# EAGLE design RC2014_SIO2 (EAGLE 9.4.2)
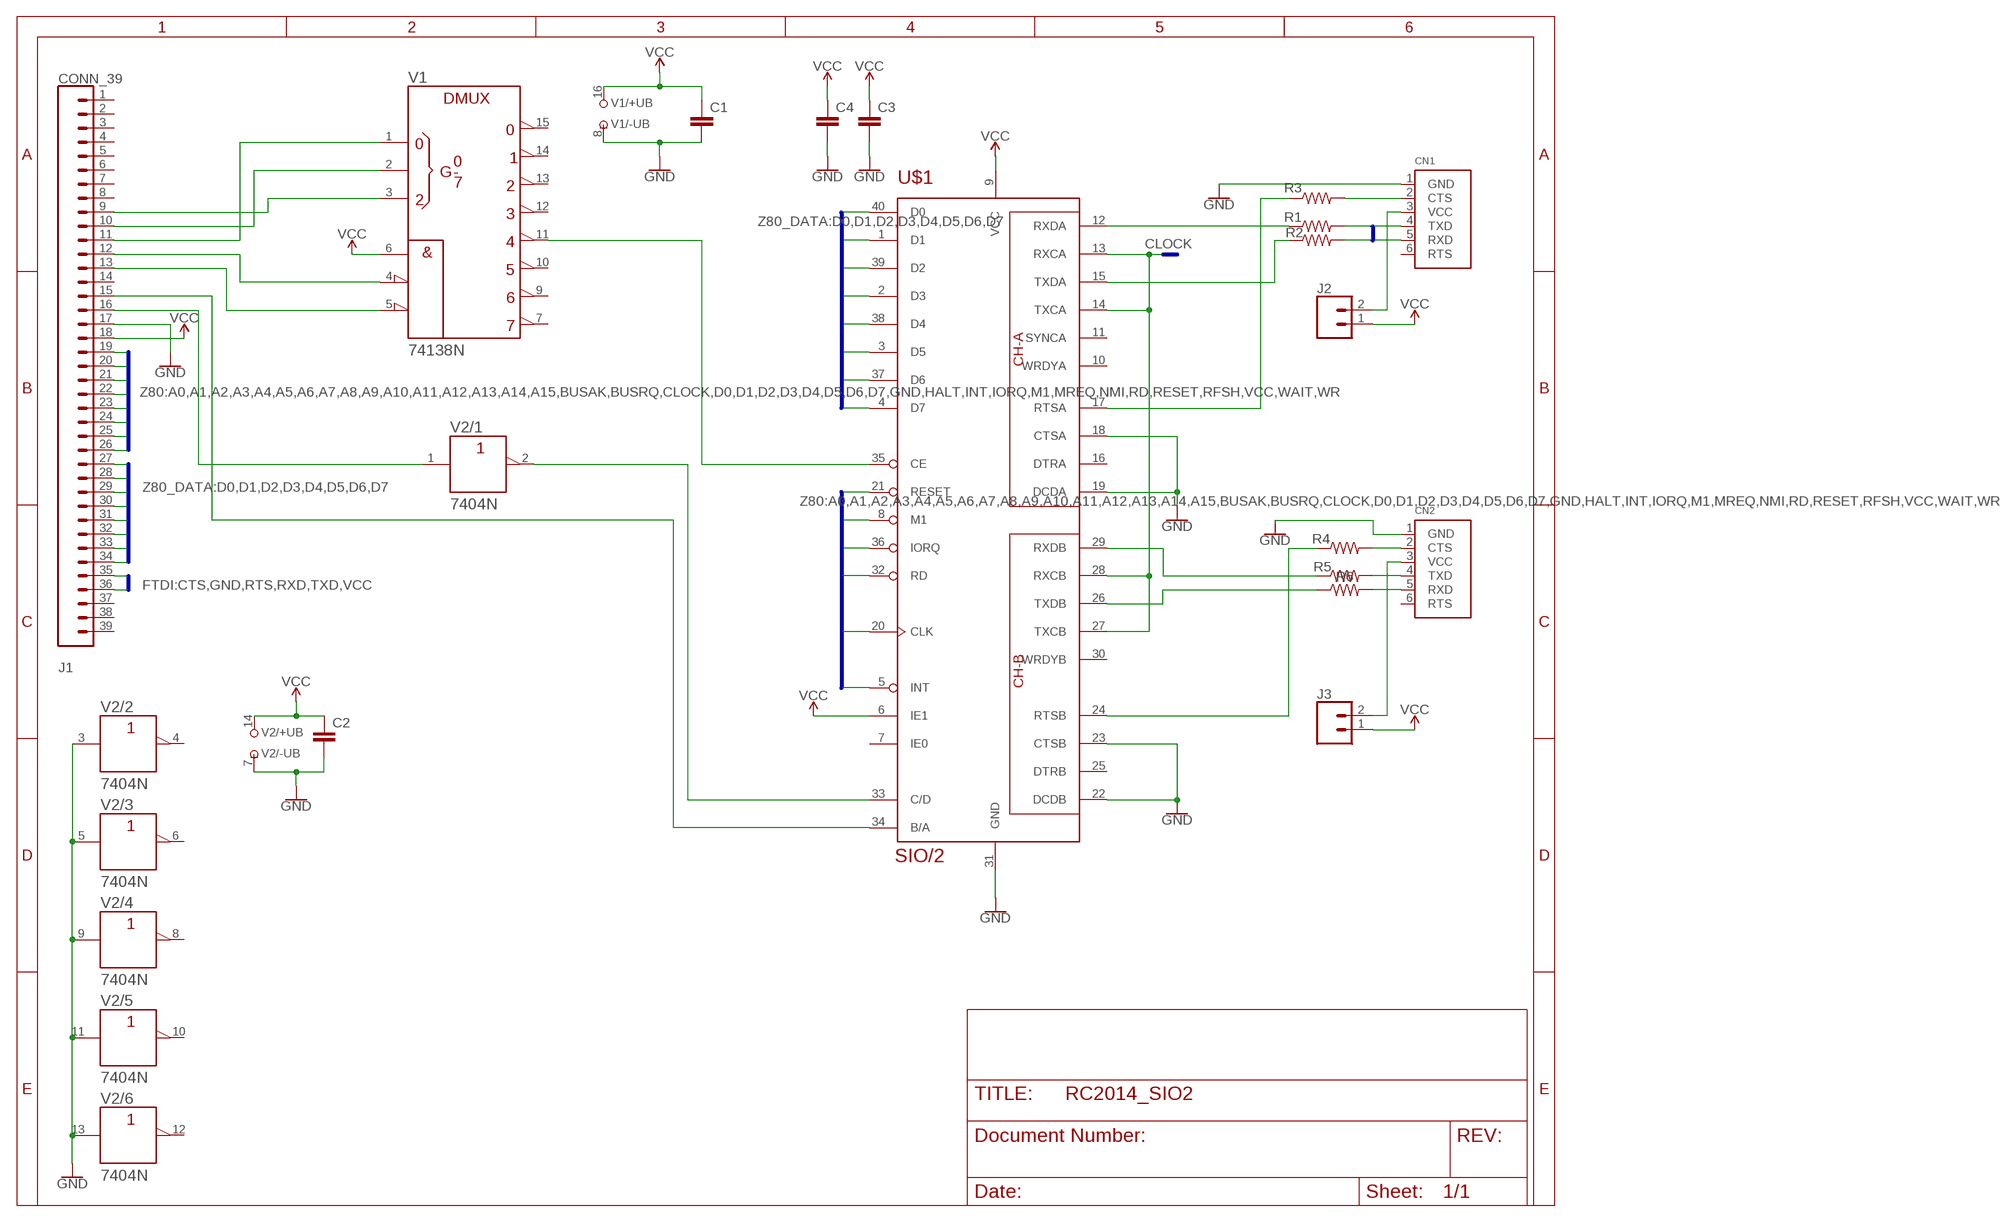
[diagram p0: schematic, sheet 1]

## Parts
C1  C2,5-3  [C2.5-3]
C2  C2,5-3  [C2.5-3]
C3  C2,5-3  [C2.5-3]
C4  C2,5-3  [C2.5-3]
CN1  FTDIUSBCABLE  [1X06_ROUND]
CN2  FTDIUSBCABLE  [1X06_ROUND]
J1  CONN_39  [1X39]
J2  CONN_02  [1X02]
J3  CONN_02  [1X02]
R1  RESISTORAXIAL-0.3  [AXIAL-0.3]
R2  RESISTORAXIAL-0.3  [AXIAL-0.3]
R3  RESISTORAXIAL-0.3  [AXIAL-0.3]
R4  RESISTORAXIAL-0.3  [AXIAL-0.3]
R5  RESISTORAXIAL-0.3  [AXIAL-0.3]
R6  RESISTORAXIAL-0.3  [AXIAL-0.3]
U$1  SIO/2  [DIL40]
V1  74138N  [DIL16]
V2  7404N  [DIL14]

## Nets
CLOCK: J1.21 U$1.13(RXCA) U$1.14(TXCA) U$1.20(CLK) U$1.27(TXCB) U$1.28(RXCB)
D0: J1.27 U$1.40(D0)
D1: J1.28 U$1.1(D1)
D2: J1.29 U$1.39(D2)
D3: J1.30 U$1.2(D3)
D4: J1.31 U$1.38(D4)
D5: J1.32 U$1.3(D5)
D6: J1.33 U$1.37(D6)
D7: J1.34 U$1.4(D7)
GND: C1.2 C2.2 C3.2 C4.2 CN1.1(GND) CN2.1(GND) J1.17 U$1.18(CTSA) U$1.19(DCDA) U$1.22(DCDB) U$1.23(CTSB) U$1.31(GND) V1.8(-UB) V2.3(/2:A) V2.5(/3:A) V2.7(/-UB:-UB) V2.9(/4:A) V2.11(/5:A) V2.13(/6:A)
INT: J1.22 U$1.5(INT)
IORQ: J1.26 U$1.36(IORQ)
M1: J1.19 U$1.8(M1)
MREQ: J1.23
N$1: J1.16 V2.1(/1:A)
N$2: J1.15 U$1.34(B/A)
N$3: U$1.33(C/D) V2.2(/1:Y)
N$4: J1.13 V1.5(!G2B)
N$5: J1.12 V1.4(!G2A)
N$6: R1.P$1 U$1.12(RXDA)
N$7: J1.11 V1.1(A)
N$8: J1.10 V1.2(B)
N$9: J1.9 V1.3(C)
N$10: U$1.35(CE) V1.11(Y4)
N$11: R2.P$1 U$1.15(TXDA)
N$12: R3.P$1 U$1.17(RTSA)
N$13: CN1.2(CTS) R3.P$2
N$14: CN2.2(CTS) R4.P$2
N$15: CN2.4(TXD) R5.P$2
N$16: CN2.5(RXD) R6.P$2
N$17: R5.P$1 U$1.29(RXDB)
N$18: R6.P$1 U$1.26(TXDB)
N$19: CN1.3(VCC) J2.2
N$20: R4.P$1 U$1.24(RTSB)
N$21: CN2.3(VCC) J3.2
RD: J1.25 U$1.32(RD)
RESET: J1.20 U$1.21(RESET)
RXD: CN1.4(TXD) J1.36 R1.P$2
TXD: CN1.5(RXD) J1.35 R2.P$2
VCC: C1.1 C2.1 C3.1 C4.1 J1.18 J2.1 J3.1 U$1.6(IE1) U$1.9(VCC) V1.6(G1) V1.16(+UB) V2.14(/+UB:+UB)
WR: J1.24
Unconnected: CN1.6(RTS) CN2.6(RTS) J1.1 J1.2 J1.3 J1.4 J1.5 J1.6 J1.7 J1.8 J1.14 J1.37 J1.38 J1.39 U$1.7(IE0) U$1.10(WRDYA) U$1.11(SYNCA) U$1.16(DTRA) U$1.25(DTRB) U$1.30(WRDYB) V1.7(Y7) V1.9(Y6) V1.10(Y5) V1.12(Y3) V1.13(Y2) V1.14(Y1) V1.15(Y0) V2.4(/2:Y) V2.6(/3:Y) V2.8(/4:Y) V2.10(/5:Y) V2.12(/6:Y)

## Buses
Z80:A0,A1,A2,A3,A4,A5,A6,A7,A8,A9,A10,A11,A12,A13,A14,A15,BUSAK,BUSRQ,CLOCK,D0,D1,D2,D3,D4,D5,D6,D7,GND,HALT,INT,IORQ,M1,MREQ,NMI,RD,RESET,RFSH,VCC,WAIT,WR
Z80_DATA:D0,D1,D2,D3,D4,D5,D6,D7
FTDI:CTS,GND,RTS,RXD,TXD,VCC

## Library data of the parts
C1-C4 = capacitor-wima:C: CAPACITOR naming: grid - package width
CN1 CN2 = microbuilder:FTDIUSBCABLE: FTDI TTL-232R USB Cable Connector for FTDI's USB->RS232 Cable
J1 = wntrmute:CONN_39
J2 J3 = SparkFun-Connectors:CONN_02: Multi connection point. Often used as Generic Header-pin footprint for 0.1 inch spaced/style header connections On any of the 0.1 inch spaced packages, you can populate with these: Break Away Headers - Straight <https://www.sparkfun.com/products/116> (PRT-00116) Break Away Male Headers - Right Angle <https://www.sparkfun.com/products/553> (PRT-00553) Female Headers <https://www.sparkfun.com/products/115> (PRT-00115) Break Away Headers - Machine Pin <https://www.sparkfun.com/products/117> (PRT-00117) Break Away Female Headers - Swiss Machine Pin <https://www.sparkfun.com/products/743> (PRT-00743) For SCREWTERMINALS and SPRING TERMINALS visit here: Screw Terimnals on SparkFun.com <https://www.sparkfun.com/search/results?term=Screw+Terminals> (5mm/3.5mm/2.54mm spacing) This device is also useful as a general connection point to wire up your design to another part of your project. Our various solder wires solder well into these plated through hole pads. Hook-Up Wire - Assortment (Stranded, 22 AWG) <https://www.sparkfun.com/products/11375> (PRT-11375) Hook-Up Wire - Assortment (Solid Core, 22 AWG) <https://www.sparkfun.com/products/11367> (PRT-11367) View the entire wire category on our website here <https://www.sparkfun.com/categories/141> Special notes: Molex polarized connector foot print use with: PRT-08233 with associated crimp pins and housings. 2.54_SCREWTERM for use with PRT-10571. 3.5mm Screw Terminal footprints for PRT-08084 5mm Screw Terminal footprints for use with PRT-08432
R1-R6 = SparkFun-Resistors:RESISTOR: Generic Resistor Package
U$1 = wntrmute:SIO/2
V1 = 74ttl-din:74*138: 3-line to 8-line DECODER/DEMULTIPLEXER
V2 = 74ttl-din:74*04: Hex INVERTER

## Net classes
0 default: width 0.152 mm, drill 0.254 mm, clearance 0.152 mm

## Board
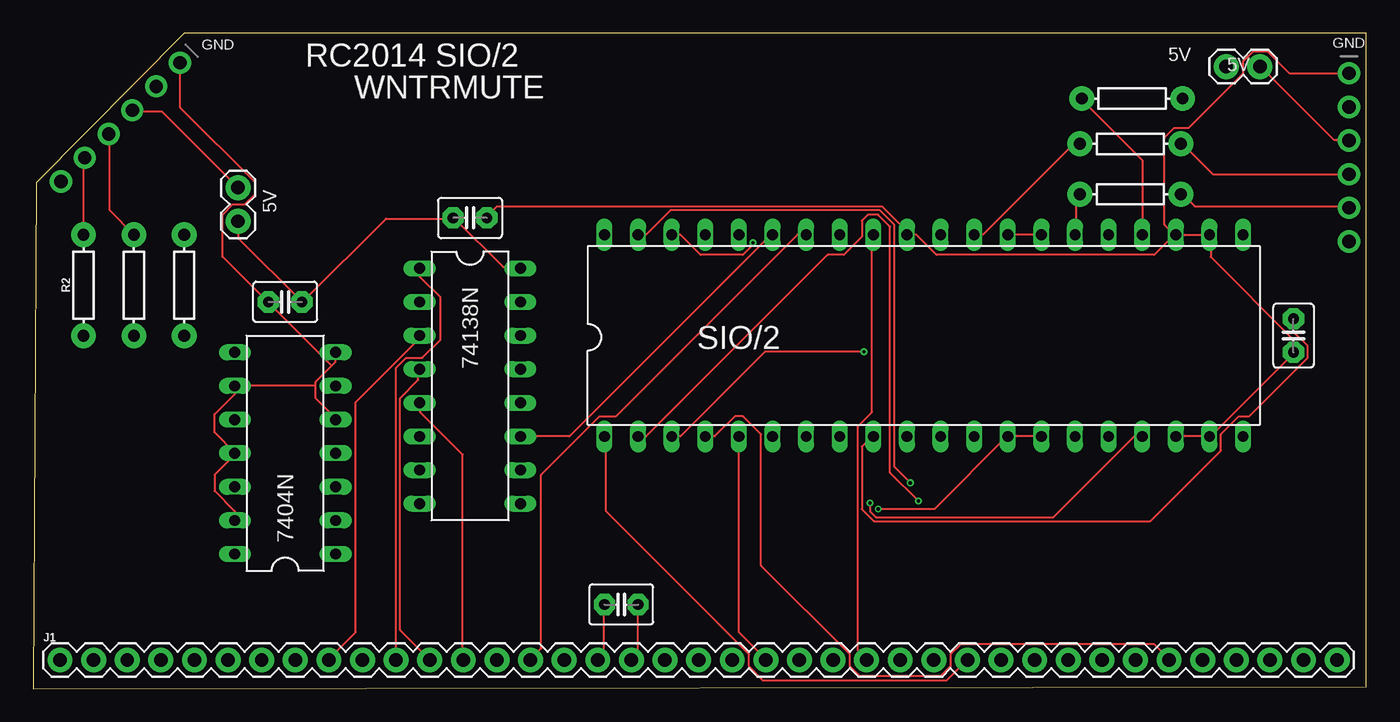
[diagram p1: board, top side]
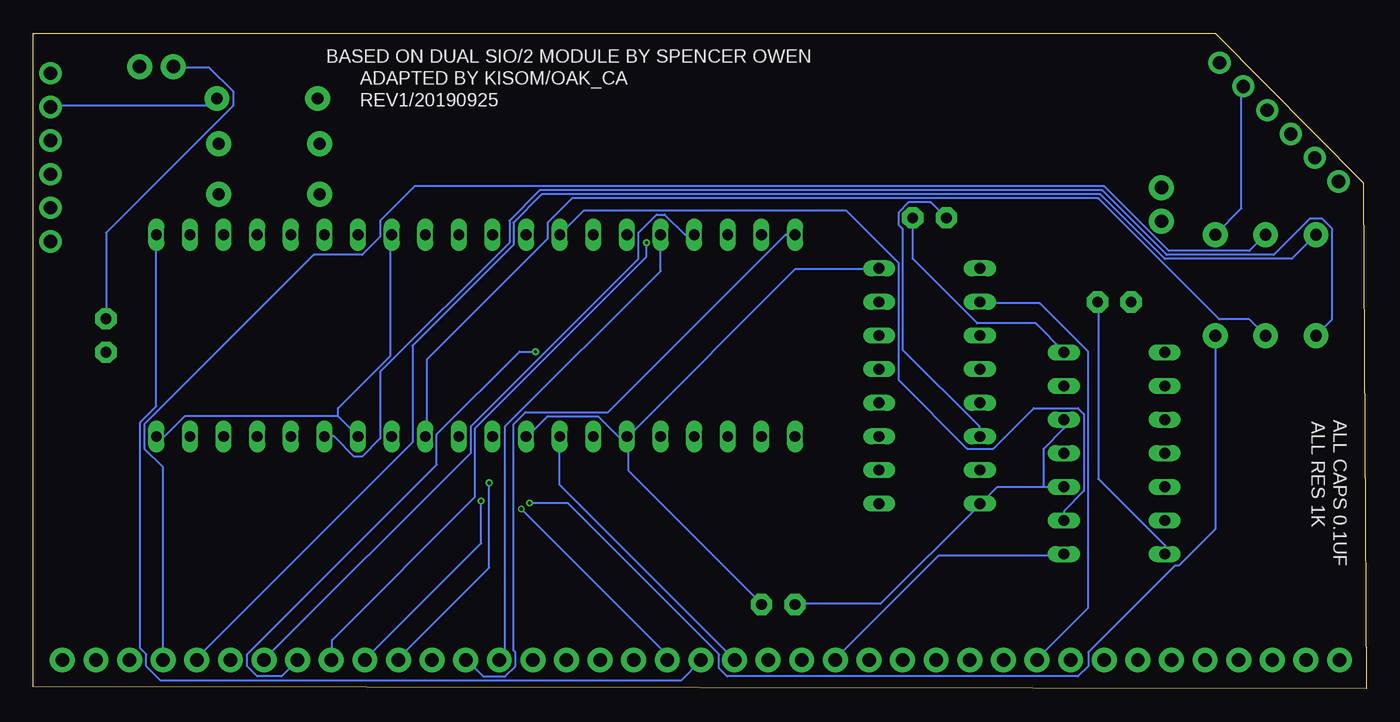
[diagram p2: board, bottom side, seen from below]

Size 100.76 x 49.52 mm. Coordinates in mm from the lower left corner, seen from the top.
Outline: 0,0 100.76,0.13 100.76,49.52 11.43,49.52 0.25,38.23 0,0
Copper layers (1*16): Top 0.035559375mm / dielectric 1.6mm / Bottom 0.035559375mm
Design rules "oshpark-2layer": minimum track width 6mil, minimum drill 10mil, track to track 6mil, track to pad 6mil, pad to pad 6mil, via to via 6mil, smd to smd 6mil, copper to edge 15mil, drill to drill 6mil, minimum pad ring 5mil, minimum via ring 5mil, stop-mask expansion 2.5mil, vias tented up to drill 0mil, thermal gap 10mil

### Footprints (pad centres in the part's own frame; a part is rotated, then mirrored left to right if it is on the bottom)
C2.5-3 = drill 0.813 pad 1.6 octagon: 1 -1.27,0; 2 1.27,0
1X06_ROUND = drill 1 pad 1.676: 1 -6.35,0; 2 -3.81,0; 3 -1.27,0; 4 1.27,0; 5 3.81,0; 6 6.35,0
1X39 = drill 1.016 pad 1.88: 1 0,0; 2 2.54,0; 3 5.08,0; 4 7.62,0; 5 10.16,0; 6 12.7,0; 7 15.24,0; 8 17.78,0; 9 20.32,0; 10 22.86,0; 11 25.4,0; 12 27.94,0; 13 30.48,0; 14 33.02,0; 15 35.56,0; 16 38.1,0; 17 40.64,0; 18 43.18,0; 19 45.72,0; 20 48.26,0; 21 50.8,0; 22 53.34,0; 23 55.88,0; 24 58.42,0; 25 60.96,0; 26 63.5,0; 27 66.04,0; 28 68.58,0; 29 71.12,0; 30 73.66,0; 31 76.2,0; 32 78.74,0; 33 81.28,0; 34 83.82,0; 35 86.36,0; 36 88.9,0; 37 91.44,0; 38 93.98,0; 39 96.52,0
1X02 = drill 1.016 pad 1.88: 1 0,0; 2 2.54,0
AXIAL-0.3 = drill 0.9 pad 1.88: P$1 -3.81,0; P$2 3.81,0
DIL40 = drill 0.813 long: 1 -24.13,-7.62; 2 -21.59,-7.62; 3 -19.05,-7.62; 4 -16.51,-7.62; 5 -13.97,-7.62; 6 -11.43,-7.62; 7 -8.89,-7.62; 8 -6.35,-7.62; 9 -3.81,-7.62; 10 -1.27,-7.62; 11 1.27,-7.62; 12 3.81,-7.62; 13 6.35,-7.62; 14 8.89,-7.62; 15 11.43,-7.62; 16 13.97,-7.62; 17 16.51,-7.62; 18 19.05,-7.62; 19 21.59,-7.62; 20 24.13,-7.62; 21 24.13,7.62; 22 21.59,7.62; 23 19.05,7.62; 24 16.51,7.62; 25 13.97,7.62; 26 11.43,7.62; 27 8.89,7.62; 28 6.35,7.62; 29 3.81,7.62; 30 1.27,7.62; 31 -1.27,7.62; 32 -3.81,7.62; 33 -6.35,7.62; 34 -8.89,7.62; 35 -11.43,7.62; 36 -13.97,7.62; 37 -16.51,7.62; 38 -19.05,7.62; 39 -21.59,7.62; 40 -24.13,7.62
DIL16 = drill 0.813 long: 1 -8.89,-3.81; 2 -6.35,-3.81; 3 -3.81,-3.81; 4 -1.27,-3.81; 5 1.27,-3.81; 6 3.81,-3.81; 7 6.35,-3.81; 8 8.89,-3.81; 9 8.89,3.81; 10 6.35,3.81; 11 3.81,3.81; 12 1.27,3.81; 13 -1.27,3.81; 14 -3.81,3.81; 15 -6.35,3.81; 16 -8.89,3.81
DIL14 = drill 0.813 long: 1 -7.62,-3.81; 2 -5.08,-3.81; 3 -2.54,-3.81; 4 0,-3.81; 5 2.54,-3.81; 6 5.08,-3.81; 7 7.62,-3.81; 8 7.62,3.81; 9 5.08,3.81; 10 2.54,3.81; 11 0,3.81; 12 -2.54,3.81; 13 -5.08,3.81; 14 -7.62,3.81

### Placement (x,y rotation side)
C1  19.05,29.21 180 top
C2  33.02,35.56 0 top
C3  95.25,26.67 270 top
C4  44.45,6.35 180 top
CN1  6.6,42.8 225 top
CN2  99.44,40.13 270 top
J1  2.03,2.16 0 top
J2  15.49,35.31 90 top
J3  90.17,46.99 0 top
R1  7.62,30.48 90 top
R2  3.81,30.48 90 top
R3  11.43,30.48 90 top
R4  83.06,44.58 0 top
R5  82.93,41.15 0 top
R6  82.93,37.34 0 top
U$1  67.31,26.67 0 top
V1  33.02,22.86 270 top
V2  19.05,17.78 90 top

### Tracks (layer width: path | path; a pad name or v marks a point on that pad's centre or on a via)
CLOCK  (via drill 0.25)
  Top 0.152: U$1.27 U$1.28 | U$1.14 U$1.13 73.61,19.05 68.12,13.56 v63.86,13.56
  Bottom 0.152: U$1.20 90.83,19.05 89.31,20.57 77.72,20.57 | U$1.14 77.72,20.57 | 77.72,20.57 77.72,21.18 73.76,25.15 73.76,34.29 U$1.28 | v63.86,13.56 52.88,2.59 52.88,2.29 J1.21
D0
  Bottom 0.152: U$1.40 43.89,34.29 57.3,20.88 63.55,20.88 64.47,19.96 64.47,2.9 64.31,2.74 64.31,1.68 65.08,0.91 66.75,0.91 67.97,2.13 J1.27
D1
  Top 0.152: U$1.1 43.28,19.05 43.28,13.41 54.1,2.59 54.1,1.68 55.17,0.61 69.04,0.61 70.56,2.13 J1.28
D2  (via drill 0.25)
  Top 0.152: U$1.39 46.33,34.29 48.16,36.12 64.01,36.12 65.08,35.05 65.08,16.76 v66.29,15.54
  Bottom 0.152: v66.29,15.54 66.29,9.14 73.15,2.29 J1.29
D3  (via drill 0.25)
  Top 0.152: U$1.2 46.33,19.05 60.05,32.77 61.27,32.77 62.64,34.14 62.64,35.36 63.09,35.81 63.86,35.81 64.77,34.9 64.77,16.31 v66.9,14.17
  Bottom 0.152: v66.9,14.17 66.9,10.97 75.59,2.29 J1.30
D4  (via drill 0.25)
  Top 0.152: U$1.38 48.92,34.29 50.44,32.77 53.65,32.77 54.41,33.53 v54.41,33.68
  Bottom 0.152: v54.41,33.68 54.41,32.61 67.36,19.66 67.36,14.48 78.18,3.66 78.18,2.29 J1.31
D5  (via drill 0.25)
  Top 0.152: U$1.3 48.92,19.05 55.32,25.45 v62.79,25.45
  Bottom 0.152: v62.79,25.45 64.01,25.45 70.26,19.2 70.26,16.92 84.58,2.59 84.58,1.68 83.82,0.91 81.99,0.91 80.77,2.13 J1.32
D6
  Bottom 0.152: U$1.37 51.51,34.29 53.03,35.81 53.65,35.81 55.02,34.44 55.02,32.46 67.67,19.81 67.67,17.83 83.21,2.29 J1.33
D7
  Top 0.152: U$1.4 51.51,19.05 53.03,20.57 53.65,20.57 55.02,19.2 55.02,9.3 61.72,2.59 61.72,1.68 62.48,0.91 68.58,0.91 69.34,1.68 69.34,2.59 70.1,3.35 84.73,3.35 85.8,2.29 J1.34
GND
  Top 0.152: U$1.18 U$1.19 89,19.05 95.25,25.3 C3.2 95.25,26.36 89,32.61 89,34.29 U$1.22 U$1.23 86.26,34.29 | 86.26,34.29 84.73,32.77 68.28,32.77 66.75,34.29 U$1.31 65.99,34.29 65.99,34.59 64.16,36.42 35.05,36.42 34.29,35.66 C2.2 | CN2.1 94.94,46.48 93.27,48.16 92.2,48.16 91.44,47.4 91.44,46.48 87.33,42.37 86.26,42.37 85.5,41.6 85.5,35.05 86.26,34.29 | V2.13 15.24,13.41 13.72,14.94 13.72,16.15 15.24,17.68 V2.11 15.24,17.83 13.72,19.36 13.72,20.73 15.24,22.25 V2.9 21.34,22.86 | C4.2 43.13,6.25 43.13,2.74 42.67,2.29 J1.17 | V2.7 22.86,24.69 22.55,24.38 | 22.55,24.38 21.34,23.16 21.34,22.86 | 21.34,22.86 21.34,21.95 22.86,20.42 V2.5 | 22.55,24.38 17.83,29.11 C1.2 17.68,29.26 14.33,32.61 14.33,35.81 15.09,36.58 16,36.58 16.76,37.34 16.76,38.25 11.12,43.89 11.12,47.24 CN1.1
  Bottom 0.152: 24.38,15.24 27.89,15.24 29.11,14.02 V1.8 29.26,13.87 36.73,6.4 43.13,6.4 C4.2 | 24.38,15.24 V2.3 | V2.5 22.86,19.66 24.38,18.14 24.38,15.24 | C2.2 34.29,32.46 29.41,27.58 24.99,27.58 22.86,25.45 V2.7
INT
  Top 0.152: U$1.5 53.34,4.27 55.32,2.29 J1.22
IORQ
  Bottom 0.152: U$1.36 53.34,31.55 65.08,19.81 65.08,2.74 65.53,2.29 J1.26
M1
  Bottom 0.152: U$1.8 60.96,15.39 47.85,2.29 J1.19
N$1
  Bottom 0.152: V2.1 22.86,10.06 32.31,10.06 40.08,2.29 J1.16
N$2
  Top 0.152: U$1.34 57.76,34.29 44.04,20.57 42.82,20.57 38.41,16.15 38.41,3.05 37.64,2.29 J1.15
N$3
  Bottom 0.152: V2.2 22.86,13.41 21.34,14.94 21.34,20.73 21.79,21.18 25.15,21.18 28.19,18.14 30.18,18.14 35.36,23.32 35.36,32.16 39.32,36.12 59.13,36.12 U$1.33
N$4
  Top 0.152: V1.5 29.26,21.49 29.26,20.88 32.46,17.68 32.46,2.29 J1.13
N$5
  Top 0.152: V1.4 29.11,24.08 29.11,23.32 27.74,21.95 27.74,4.42 29.87,2.29 J1.12
N$6
  Bottom 0.152: R1.P$1 8.84,27.89 11.12,27.89 20.27,37.03 60.05,37.03 61.87,35.2 61.87,33.98 71.02,24.84 71.02,19.05 U$1.12
N$7
  Top 0.152: J1.11 27.43,24.23 28.19,24.99 29.41,24.99 30.79,26.36 30.79,29.57 29.26,31.09 29.26,31.7 V1.1
N$8
  Bottom 0.152: V1.2 29.11,29.11 24.69,29.11 21.03,25.45 21.03,6.1 24.84,2.29 J1.10
N$9
  Top 0.152: V1.3 29.11,26.67 29.11,26.36 24.38,21.64 24.38,4.27 22.4,2.29 J1.9
N$10
  Top 0.152: V1.11 40.54,19.05 55.78,34.29 U$1.35
N$11
  Bottom 0.152: U$1.15 78.03,19.05 76.5,17.53 75.89,17.53 74.52,18.9 74.52,23.93 64.77,33.68 64.77,35.36 62.48,37.64 19.96,37.64 15.09,32.77 7.01,32.77 4.27,35.51 3.35,35.51 2.59,34.75 2.59,27.89 R2.P$1
N$12  (via drill 0.25)
  Top 0.152: U$1.17 83.21,19.05 77.11,12.95 63.7,12.95 63.25,13.41 v63.25,14.02
  Bottom 0.152: v63.25,14.02 60.35,14.02 48.92,2.59 48.92,1.52 48.31,0.91 21.79,0.91 21.03,1.68 21.03,2.74 14.48,9.3 14.17,9.3 11.43,12.04 R3.P$1
N$13
  Bottom 0.152: R3.P$2 9.45,36.27 9.45,45.41 CN1.2
N$14
  Bottom 0.152: CN2.2 99.36,44.04 87.33,44.04 86.87,44.5 R4.P$2
N$15
  Top 0.152: CN2.4 89.15,38.86 86.87,41.15 R5.P$2
N$16
  Top 0.152: CN2.5 99.36,36.42 87.78,36.42 86.87,37.34 R6.P$2
N$17
  Top 0.152: U$1.29 71.78,34.29 78.64,41.15 R5.P$1
N$18
  Top 0.152: U$1.26 78.79,34.29 78.79,37.03 79.1,37.34 R6.P$1
N$19
  Top 0.152: J2.2 9.75,43.59 7.62,43.59 CN1.3
N$20
  Top 0.152: U$1.24 83.82,39.93 79.25,44.5 R4.P$1
N$21
  Top 0.152: CN2.3 99.36,41.45 98.3,41.45 92.81,46.94 J3.2
RD
  Top 0.152: U$1.32 63.4,34.29 63.4,20.88 62.33,19.81 62.33,2.9 62.94,2.29 J1.25
RESET
  Bottom 0.152: U$1.21 91.44,21.34 92.66,20.12 92.66,3.05 92.2,2.59 92.2,1.68 91.14,0.61 51.82,0.61 50.29,2.13 J1.20
RXD
  Top 0.152: R1.P$2 5.79,36.12 5.79,41.76 CN1.4
  Bottom 0.152: R1.P$2 8.84,33.07 14.94,33.07 19.81,37.95 71.93,37.95 74.52,35.36 74.52,34.14 75.89,32.77 79.55,32.77 92.35,19.96 92.35,18.14 90.98,16.76 90.98,2.29 J1.36
TXD
  Top 0.152: R2.P$2 3.81,40.08 CN1.5
  Bottom 0.152: R2.P$2 5.64,32.46 15.24,32.46 20.12,37.34 62.33,37.34 64.47,35.2 64.47,33.53 72.08,25.91 72.08,18.59 88.39,2.29 J1.35
VCC
  Top 0.152: V1.16 36.73,31.85 35.51,31.85 31.85,35.51 C2.1 31.7,35.51 26.67,35.51 20.42,29.26 C1.1 15.54,33.98 15.54,35.2 J2.1 | C4.1 45.72,2.74 45.26,2.29 J1.18 | C3.1 95.25,26.98 96.32,25.91 96.32,24.99 91.9,20.57 91.14,20.57 89.76,19.2 89.76,17.98 84.43,12.65 63.55,12.65 62.64,13.56 62.64,18.29 63.4,19.05 U$1.9
  Bottom 0.152: C2.1 32.92,36.73 34.59,36.73 35.36,35.97 35.36,35.05 35.05,34.75 35.05,25.6 29.26,19.81 29.26,19.05 V1.6 | V2.14 15.24,10.82 20.27,15.85 20.27,29.11 C1.1 | C3.1 95.25,34.44 85.65,44.04 85.65,45.11 87.48,46.94 90.07,46.94 J3.1 | U$1.9 63.4,19.05 61.87,20.57 58.06,20.57 56.54,19.05 U$1.6 55.78,19.05 | 55.78,19.05 55.78,16.46 45.72,6.4 C4.1 | 55.78,19.05 43.13,31.7 36.88,31.7 V1.16

### Text on the board
tPlace: GND | 5V | 5V | GND | RC2014 SIO/2 | WNTRMUTE | 5V
bPlace: BASED ON DUAL SIO/2 MODULE BY SPENCER OWEN | ADAPTED BY KISOM/OAK_CA | REV1/20190925 | ALL CAPS 0.1UF | ALL RES 1K